# Altium project camera.PrjPcb
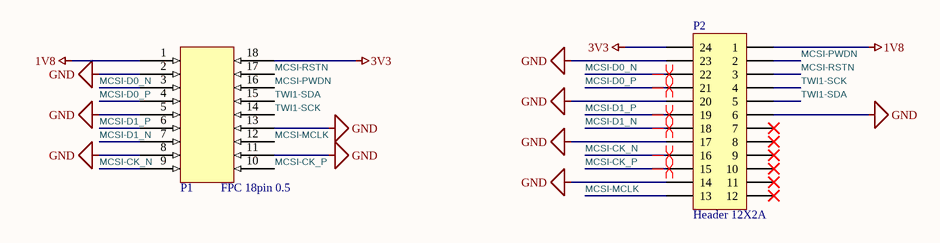
[diagram p0: Sheet1.SchDoc]
1 sheet, 2 parts. Net scope: global (net labels, ports and power ports of the same name join across sheets).
Board file: PCB1.PcbDoc

## Sheet Sheet1.SchDoc
size A4; SheetNumber: 1; SheetTotal: 1

### Parts
P1  FPC 18pin 0.5  [FPC 18pin 0.5]
P2  Header 12X2A  [BTB 24PIN]

### Nets
1V8: P1.1 P2.1
3V3: P1.18 P2.24
GND: P1.2 P1.5 P1.8 P1.11 P1.13 P2.6 P2.14 P2.17 P2.20 P2.23
MCSI-CK_N: P1.9 P2.16
MCSI-CK_P: P1.10 P2.15
MCSI-D0_N: P1.3 P2.22
MCSI-D0_P: P1.4 P2.21
MCSI-D1_N: P1.7 P2.18
MCSI-D1_P: P1.6 P2.19
MCSI-MCLK: P1.12 P2.13
MCSI-PWDN: P1.16 P2.2
MCSI-RSTN: P1.17 P2.3
TWI1-SCK: P1.14 P2.4
TWI1-SDA: P1.15 P2.5

Not connected (* = marked no-connect by the designer): P2 7* 8* 9* 10* 11* 12*

### Layout directives
differential pair; differential pair class MIPI: MCSI-CK_N, MCSI-CK_P, MCSI-D0_N, MCSI-D0_P, MCSI-D1_N, MCSI-D1_P

### Library data of the parts
P2 = Header 12X2A: Header, 12-Pin, Dual row; LatestRevisionDate: 17-Jul-2002; LatestRevisionNote: Re-released for DXP Platform.; Publisher: Altium Limited